# Altium schematic sheet Controller_SolarCharge.SchDoc
size B
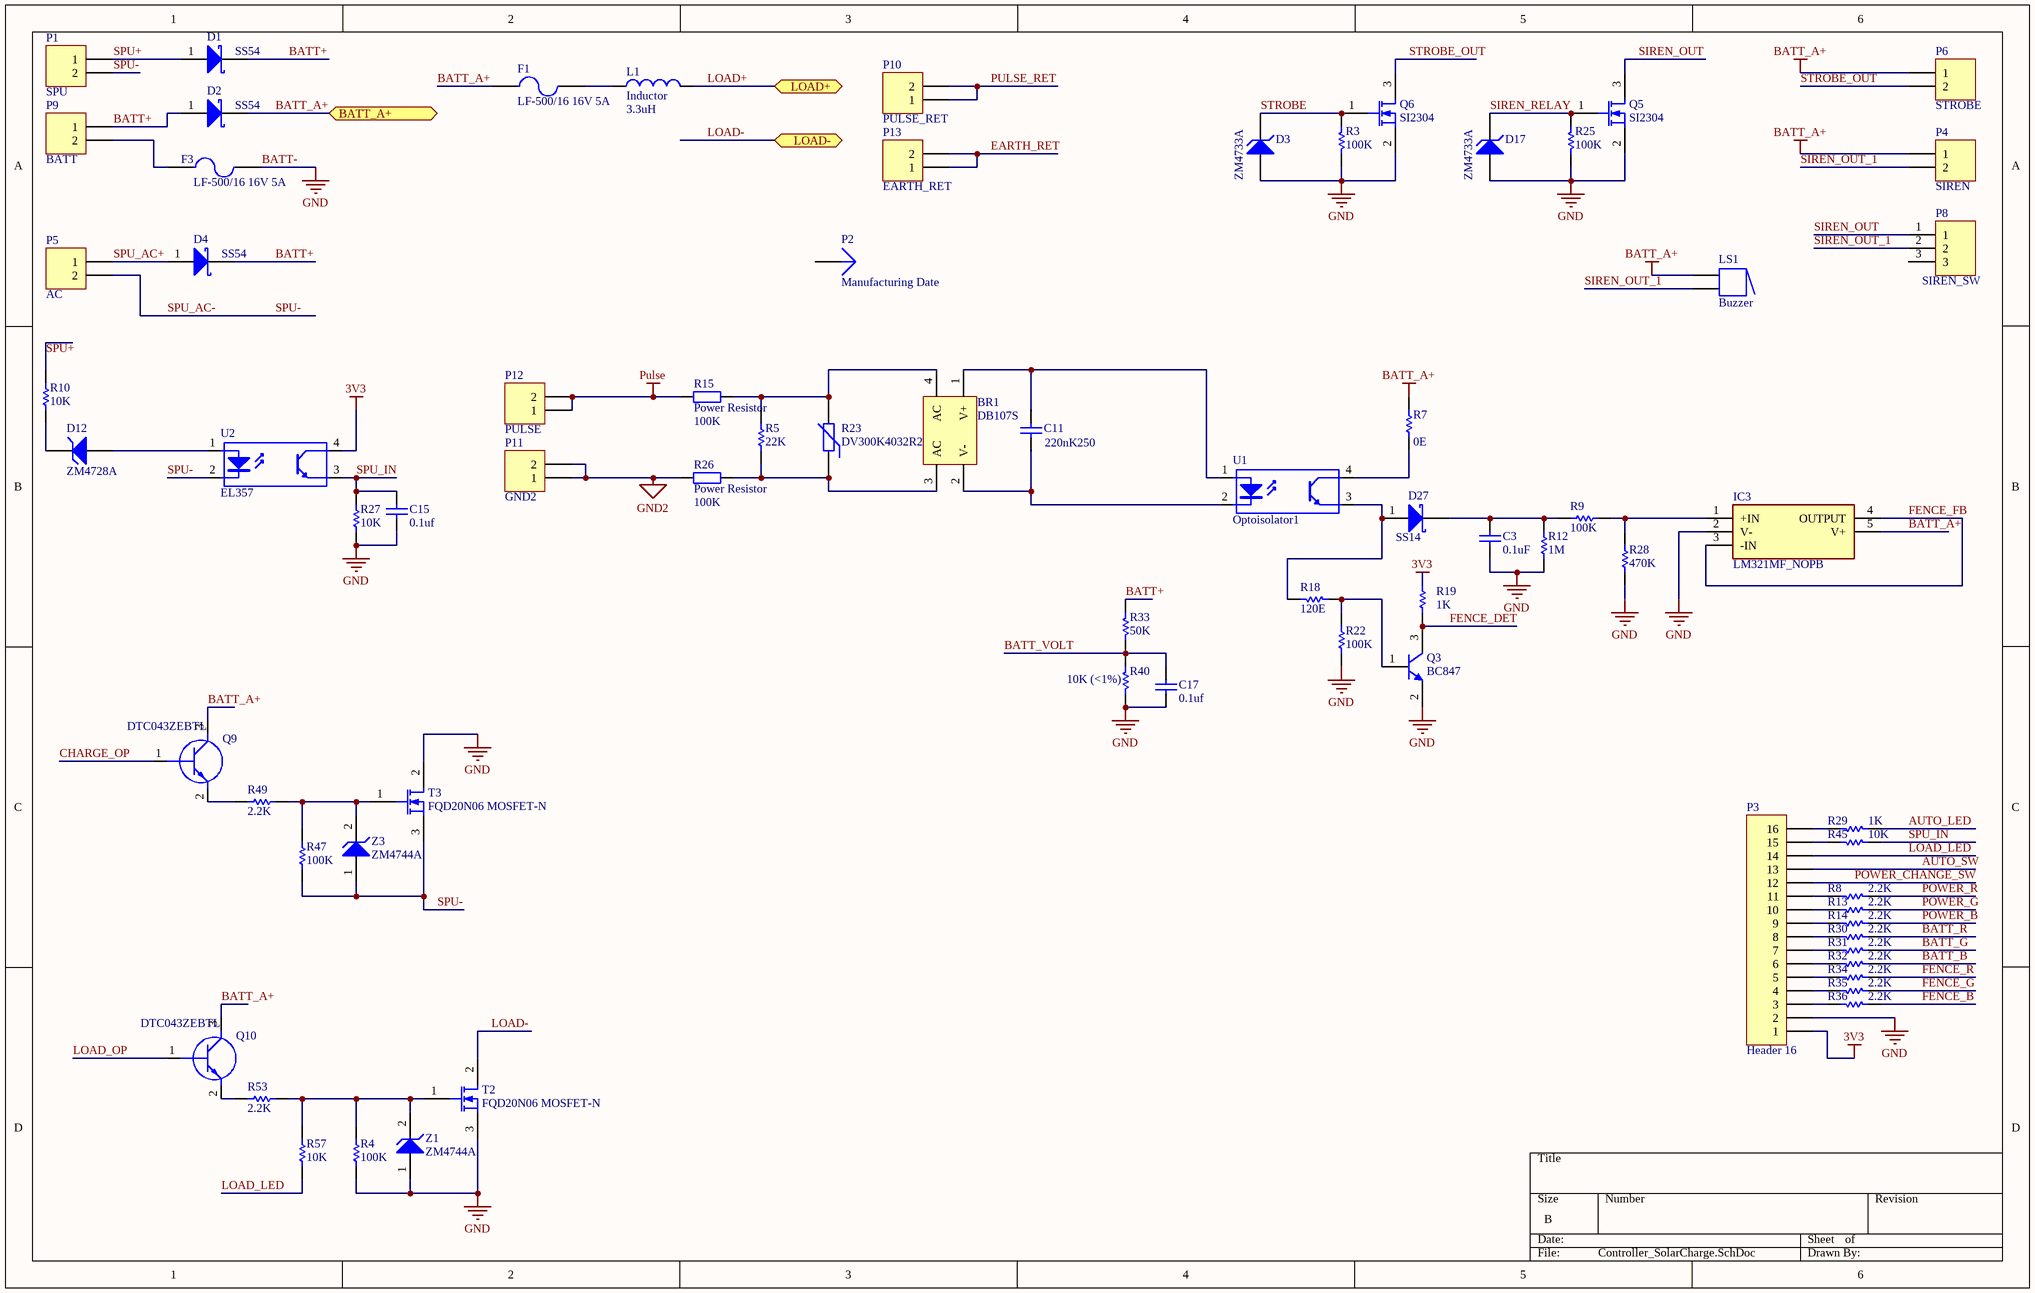
[diagram p0: Controller_SolarCharge.SchDoc]

## Parts
BR1  DB107S  [DB-S_Bridge Rectifier]
C3  value 0.1uF  [0805]  (hidden comment: Cap)
C11  value 220nK250  [RES AXIAL-0.6]  (hidden comment: Cap)
C15  value 0.1uf  [0805]  (hidden comment: Cap)
C17  value 0.1uf  [0805]  (hidden comment: Cap)
D1  SS54  [SMC]
D2  SS54  [SMC]
D3  ZM4733A  [SMA]
D4  SS54  [SMC]
D12  ZM4728A  [SMA]
D17  ZM4733A  [SMA]
D27  SS14  [SMA]
F1  LF-500/16 16V 5A  [LF500-16]
F3  LF-500/16 16V 5A  [LF500-16]
IC3  LM321MF_NOPB  [SOT95P280X145-5N]
L1  Inductor  value 3.3uH  [Inductor_SMD_3.3uh]
LS1  Buzzer  [BUZZER]
P1  SPU  [SCREW_TERMINAL 2PIN 5.08MM]
P2  Manufacturing Date  [MFT_DATE]
P3  Header 16  [FPC_CON_16PIN]
P4  SIREN  [SCREW_TERMINAL 2PIN 5.08MM]
P5  AC  [SCREW_TERMINAL 2PIN 5.08MM]
P6  STROBE  [SCREW_TERMINAL 2PIN 5.08MM]
P8  SIREN_SW  [SWITCH_SLIDE]
P9  BATT  [SCREW_TERMINAL 2PIN 5.08MM]
P10  PULSE_RET  [SCREW_TERMINAL ENERGIZER]
P11  GND2  [SCREW_TERMINAL ENERGIZER]
P12  PULSE  [SCREW_TERMINAL ENERGIZER]
P13  EARTH_RET  [SCREW_TERMINAL ENERGIZER]
Q3  BC847  [SOT-23]
Q5  SI2304  [SOT-23]
Q6  SI2304  [SOT-23]
Q9  DTC043ZEBTL  [SOTFL50P160X85-3N]
Q10  DTC043ZEBTL  [SOTFL50P160X85-3N]
R3  value 100K  [0805]  (hidden comment: Res1)
R4  value 100K  [0805]  (hidden comment: Res1)
R5  value 22K  [POWER_RES 5W_35mm]  (hidden comment: Res1)
R7  value 0E  [0805]  (hidden comment: Res1)
R8  value 2.2K  [0805]  (hidden comment: Res1)
R9  value 100K  [0805]  (hidden comment: Res1)
R10  value 10K  [0805]  (hidden comment: Res1)
R12  value 1M  [0805]  (hidden comment: Res1)
R13  value 2.2K  [0805]  (hidden comment: Res1)
R14  value 2.2K  [0805]  (hidden comment: Res1)
R15  Power Resistor  value 100K  [POWER_RES 5W_35mm]
R18  value 120E  [0805]  (hidden comment: Res1)
R19  value 1K  [0805]  (hidden comment: Res1)
R22  value 100K  [0805]  (hidden comment: Res1)
R23  DV300K4032R2  [3225k471]
R25  value 100K  [0805]  (hidden comment: Res1)
R26  Power Resistor  value 100K  [POWER_RES 5W_35mm]
R27  value 10K  [0805]  (hidden comment: Res1)
R28  value 470K  [0805]  (hidden comment: Res1)
R29  value 1K  [0805]  (hidden comment: Res1)
R30  value 2.2K  [0805]  (hidden comment: Res1)
R31  value 2.2K  [0805]  (hidden comment: Res1)
R32  value 2.2K  [0805]  (hidden comment: Res1)
R33  value 50K  [0805]  (hidden comment: Res1)
R34  value 2.2K  [0805]  (hidden comment: Res1)
R35  value 2.2K  [0805]  (hidden comment: Res1)
R36  value 2.2K  [0805]  (hidden comment: Res1)
R40  value 10K (<1%)  [0805]  (hidden comment: Res1)
R45  value 10K  [0805]  (hidden comment: Res1)
R47  value 100K  [0805]  (hidden comment: Res1)
R49  value 2.2K  [0805]  (hidden comment: Res1)
R53  value 2.2K  [0805]  (hidden comment: Res1)
R57  value 10K  [0805]  (hidden comment: Res1)
T2  FQD20N06 MOSFET-N  [TO252 (DPAK)]
T3  FQD20N06 MOSFET-N  [TO252 (DPAK)]
U1  Optoisolator1  [IR ISOLATED]
U2  EL357  [SOP4]
Z1  ZM4744A  [SMA]
Z3  ZM4744A  [SMA]

## Ports
BATT_A+, LOAD+, LOAD-

## Nets
3V3: P3.1 R19.2 U2.4(C)
BATT-: C3.2 C15.1 C17.2 D3.1(A) D17.1(A) F3.2 IC3.2(V-) P3.2 Q3.2(E) Q5.2(S) Q6.2(S) R3.1 R4.1 R12.1 R22.1 R25.1 R27.1 R28.1 R40.1 T2.3(S) T3.2(D) Z1.1(A)  [also labelled GND]
BATT_A+: D2.2 F1.1 IC3.5(V+) LS1.1 P4.1 P6.1 Q9.3(C) Q10.3(C) R7.2 ; port BATT_A+
GND2: P11.1 P11.2 R26.1
Pulse: P12.1 P12.2 R15.1
AUTO_LED: R29.1
AUTO_SW: P3.13
BATT+: D1.2 D2.1(A) D4.2 P9.1 R33.2
BATT_B: R32.1
BATT_G: R31.1
BATT_R: R30.1
BATT_VOLT: C17.1 R33.1 R40.2
CHARGE_OP: Q9.1(B)
EARTH_RET: P13.1 P13.2
FENCE_B: R36.1
FENCE_DET: Q3.3(C) R19.1
FENCE_FB: IC3.3(-IN) IC3.4(OUTPUT)
FENCE_G: R35.1
FENCE_R: R34.1
LOAD+: L1.2 ; port LOAD+
LOAD-: T2.2(D) ; port LOAD-
LOAD_LED: P3.14 R57.1
LOAD_OP: Q10.1(B)
POWER_B: R14.1
POWER_CHANGE_SW: P3.12
POWER_G: R13.1
POWER_R: R8.1
PULSE_RET: P10.1 P10.2
SIREN_OUT: P8.1 Q5.3(D)
SIREN_OUT_1: LS1.2 P4.2 P8.2
SIREN_RELAY: D17.2(K) Q5.1(G) R25.2
SPU+: D1.1(A) P1.1 R10.2
SPU-: P1.2 P5.2 R47.1 T3.3(S) U2.2(K) Z3.1(A)  [also labelled SPU_AC-]
SPU_AC+: D4.1(A) P5.1
SPU_IN: C15.2 R27.2 R45.1 U2.3(E)
STROBE: D3.2(K) Q6.1(G) R3.2
STROBE_OUT: P6.2 Q6.3(D)
NetBR1_1: BR1.1(V+) C11.2 U1.1(A)
NetBR1_2: BR1.2(V-) C11.1 U1.2(K)
NetBR1_3: BR1.3(AC) R5.2 R23.1 R26.2
NetBR1_4: BR1.4(AC) R5.1 R15.2 R23.2
NetC3_1: C3.1 D27.2 R9.2 R12.2
NetD12_1: D12.1(A) U2.1(A)
NetD12_2: D12.2(K) R10.1
NetD27_1: D27.1(A) R18.2 U1.3(E)
NetF1_2: F1.2 L1.1
NetF3_1: F3.1 P9.2
NetIC3_1: IC3.1(+IN) R9.1 R28.2
NetP3_3: P3.3 R36.2
NetP3_4: P3.4 R35.2
NetP3_5: P3.5 R34.2
NetP3_6: P3.6 R32.2
NetP3_7: P3.7 R31.2
NetP3_8: P3.8 R30.2
NetP3_9: P3.9 R14.2
NetP3_10: P3.10 R13.2
NetP3_11: P3.11 R8.2
NetP3_15: P3.15 R45.2
NetP3_16: P3.16 R29.2
NetQ3_1: Q3.1(B) R18.1 R22.2
NetQ9_2: Q9.2(E) R49.2
NetQ10_2: Q10.2(E) R53.2
NetR4_2: R4.2 R53.1 R57.2 T2.1(G) Z1.2(K)
NetR7_1: R7.1 U1.4(C)
NetR47_2: R47.2 R49.1 T3.1(G) Z3.2(K)

Not connected (* = marked no-connect by the designer): P2 1; P8 3

## Library data of the parts
BR1 = Bridge2: Diode Bridge; Published: 24-Mar-1999; LatestRevisionDate: 17-Jul-2002; LatestRevisionNote: Re-released for DXP Platform.; PackageReference: D-46_6A; Publisher: Altium Limited; PackageDescription: Bridge Rectifier; 4 Terminals; Body 16.8 x 16.8 mm (typ); Pitch 10.67 mm
C3 C11 C15 C17 = Cap: Capacitor; Published: 8-Jun-2000; LatestRevisionDate: 17-Jul-2002; LatestRevisionNote: Re-released for DXP Platform.; PackageReference: RAD-0.3; Publisher: Altium Limited; PackageDescription: Radial Cap, Thru-Hole; 2 Leads; 0.3 in Pin Spacing
D1 D2 D4 D27 = Diode BAT17: Silicon RF Schottky Diode for Mixer Applications in the VHF/UHF Range; Note: Pin 2 is not connected and not drawn.; Published: 21-Mar-2003; LatestRevisionDate: 29-May-2009; LatestRevisionNote: IPC-7351 Footprint Added.; DatasheetVersion: Oct-1999; PackageVersion: Sep-2001; PackageReference: SOT-23; Publisher: Altium Limited; PackageDescription: 3-Pin SOT-23 Package 0.95 mm Pitch, 2.5 mm Lead Span; ComponentLink1Description: Manufacturer Link; ComponentLink1URL: http://www.infineon.com/; ComponentLink2Description: Datasheet; ComponentLink2URL: http://www.infineon.com/upload/Document/cmc_upload/documents/009/363/bat17series.pdf
D3 D17 = D Zener: TVS Diode; Published: 8-Jun-2000; LatestRevisionDate: 17-Jul-2002; LatestRevisionNote: Re-released for DXP Platform.; PackageReference: DIODE-0.7; Publisher: Altium Limited; PackageDescription: Diode, Thru-Hole; 2 Leads; 0.7 in Pin Spacing
D12 Z1 Z3 = D Zener: Zener Diode; Published: 8-Jun-2000; LatestRevisionDate: 17-Jul-2002; LatestRevisionNote: Re-released for DXP Platform.; PackageReference: DIODE-0.7; Publisher: Altium Limited; PackageDescription: Diode, Thru-Hole; 2 Leads; 0.7 in Pin Spacing
F1 F3 = Fuse 2: Fuse; Published: 8-Jun-2000; LatestRevisionDate: 17-Jul-2002; LatestRevisionNote: Re-released for DXP Platform.; PackageReference: PIN-W2/E2.8; Publisher: Altium Limited; PackageDescription: Thru-Hole; 2 Leads
IC3 = LM321MF_NOPB: Integrated Circuit; Manufacturer_Name: Texas Instruments; Manufacturer_Part_Number: LM321MF/NOPB; Datasheet Link: https://datasheet.datasheetarchive.com/originals/distributors/Datasheets-SFU2/DSASFU100036193.pdf; Height: 1.45mm; Mouser Part Number: 926-LM321MF/NOPB; Mouser Price/Stock: https://www.mouser.co.uk/ProductDetail/Texas-Instruments/LM321MF-NOPB?qs=X1J7HmVL2ZEjaSKPrGsivQ%3D%3D; Arrow Part Number: LM321MF/NOPB; Arrow Price/Stock: https://www.arrow.com/en/products/lm321mfnopb/texas-instruments?region=nac
L1 = Inductor: Code_IEC: 1005; Published: 8-Jun-2000; LatestRevisionDate: 29-May-2009; LatestRevisionNote: IPC-7351 Footprint Added.; PackageReference: 0402-A; Publisher: Altium Limited; PackageDescription: Chip Inductor; Code_JEITA: 0402
LS1 = Buzzer: Magnetic Transducer Buzzer; Published: 24-Mar-1999; LatestRevisionDate: 17-Dec-2003; LatestRevisionNote: Schematic revised, PCB Footprint replaced.; DatasheetVersion: 17-Dec-2003; PackageReference: ABSM-1574; Publisher: Altium Limited; PackageDescription: Magnetic Transducer Buzzer; ComponentLink1Description: Manufacturer Link; ComponentLink1URL: http://www.megastar.com/linecard/buzzmode/index.php
P1 P4-P6 P9 = Header 2: SCREW_TERMINAL 2PIN 5.08MM; LatestRevisionDate: 17-Jul-2002; LatestRevisionNote: Re-released for DXP Platform.; Publisher: Altium Limited
P2 = Plug: LatestRevisionDate: 17-Jul-2002; LatestRevisionNote: Re-released for DXP Platform.; Publisher: Altium Limited
P3 = Header 16: Header, 16-Pin; LatestRevisionDate: 17-Jul-2002; LatestRevisionNote: Re-released for DXP Platform.; Publisher: Altium Limited
P8 = Header 3: Header, 3-Pin; LatestRevisionDate: 17-Jul-2002; LatestRevisionNote: Re-released for DXP Platform.; Publisher: Altium Limited
P10 P12 = Header 2: SCREW_TERMINAL 2PIN 9.25MM; LatestRevisionDate: 17-Jul-2002; LatestRevisionNote: Re-released for DXP Platform.; Publisher: Altium Limited
P11 P13 = Header 2: Header, 2-Pin; LatestRevisionDate: 17-Jul-2002; LatestRevisionNote: Re-released for DXP Platform.; Publisher: Altium Limited
Q3 = 2N3904: NPN General Purpose Amplifier; Published: 8-Jun-2000; LatestRevisionDate: 15-Jan-2003; LatestRevisionNote: PCB Footprint 'BCY-W3/D4.7' replaced; DatasheetVersion: 1997; PackageVersion: Sep-1998; PackageReference: TO-92A; Publisher: Altium Limited; PackageDescription: TO, Flat Index; 3 In-Line, Axial Leads; Body Dia. 4.5mm; Leads 0.51 x 0.48 mm (max); ComponentLink1Description: Manufacturer Link; ComponentLink1URL: http://www.fairchildsemi.com/; ComponentLink2Description: Datasheet; ComponentLink2URL: http://www.fairchildsemi.com/ds/2N%2F2N3904.pdf
Q5 Q6 = MOSFET-N: SI2304 A4SHB MOSFET-N; Published: 8-Jun-2000; LatestRevisionDate: 17-Jul-2002; LatestRevisionNote: Re-released for DXP Platform.; PackageVersion: 1995/1996; PackageReference: E3; Publisher: Altium Limited; PackageDescription: TO, Flat Index; 3 In-Line, Axial Leads; Body Dia. 4.6mm; Lead Dia. 0.5 mm (max)
Q9 Q10 = DTC043ZEBTL: Transistor BJT NPN; Manufacturer_Name: ROHM Semiconductor; Datasheet Link: http://rohmfs.rohm.com/en/products/databook/datasheet/discrete/transistor/digital/dtc043zmt2l-e.pdf; Height: 0.85mm; Manufacturer_Part_Number: DTC043ZEBTL; Mouser Part Number: 755-DTC043ZEBTL; Mouser Price/Stock: https://www.mouser.co.uk/ProductDetail/ROHM-Semiconductor/DTC043ZEBTL?qs=n7vHx8wJlDGyWrBOh0icRQ%3D%3D
R3-R5 R7-R10 R12-R14 R18 R19 R22 R25 R27-R36 R40 R45 R47 R49 R53 R57 = Res1: Resistor; Published: 8-Jun-2000; LatestRevisionDate: 17-Jul-2002; LatestRevisionNote: Re-released for DXP Platform.; PackageReference: AXIAL-0.3; Publisher: Altium Limited; PackageDescription: Axial Device, Thru-Hole; 2 Leads; 0.3 in Pin Spacing
R15 R26 = Res2: Resistor; Published: 8-Jun-2000; LatestRevisionDate: 17-Jul-2002; LatestRevisionNote: Re-released for DXP Platform.; PackageReference: AXIAL-0.4; Publisher: Altium Limited; PackageDescription: Axial Device, Thru-Hole; 2 Leads; 0.4 in Pin Spacing
R23 = Res Varistor: Varistor (Voltage-Sensitive Resistor); Published: 24-Mar-1999; LatestRevisionDate: 29-May-2009; LatestRevisionNote: IPC-7351 Footprint Added.; PackageVersion: Mar-2003; PackageReference: 6-0805; Publisher: Altium Limited; PackageDescription: Chip Resistor 0805 Case Size; Code_IPC: RESC2012
T2 T3 = MOSFET-N: N-Channel MOSFET; Published: 8-Jun-2000; LatestRevisionDate: 17-Jul-2002; LatestRevisionNote: Re-released for DXP Platform.; PackageVersion: 1995/1996; PackageReference: E3; Publisher: Altium Limited; PackageDescription: TO, Flat Index; 3 In-Line, Axial Leads; Body Dia. 4.6mm; Lead Dia. 0.5 mm (max)
U1 = Optoisolator1: Optocoupler for Return; Published: 24-Mar-1999; LatestRevisionDate: 04-Mar-2005; LatestRevisionNote: Sch pins 3 & 4 Swapped.; DatasheetVersion: Nov-2003; PackageReference: DIP-4; Publisher: Altium Limited
U2 = Optoisolator1: 4-Pin Phototransistor Optocoupler; Published: 24-Mar-1999; LatestRevisionDate: 04-Mar-2005; LatestRevisionNote: Sch pins 3 & 4 Swapped.; DatasheetVersion: Nov-2003; PackageReference: DIP-4; Publisher: Altium Limited